# EAGLE design esp8266-blynk2 (EAGLE 7.5.0)
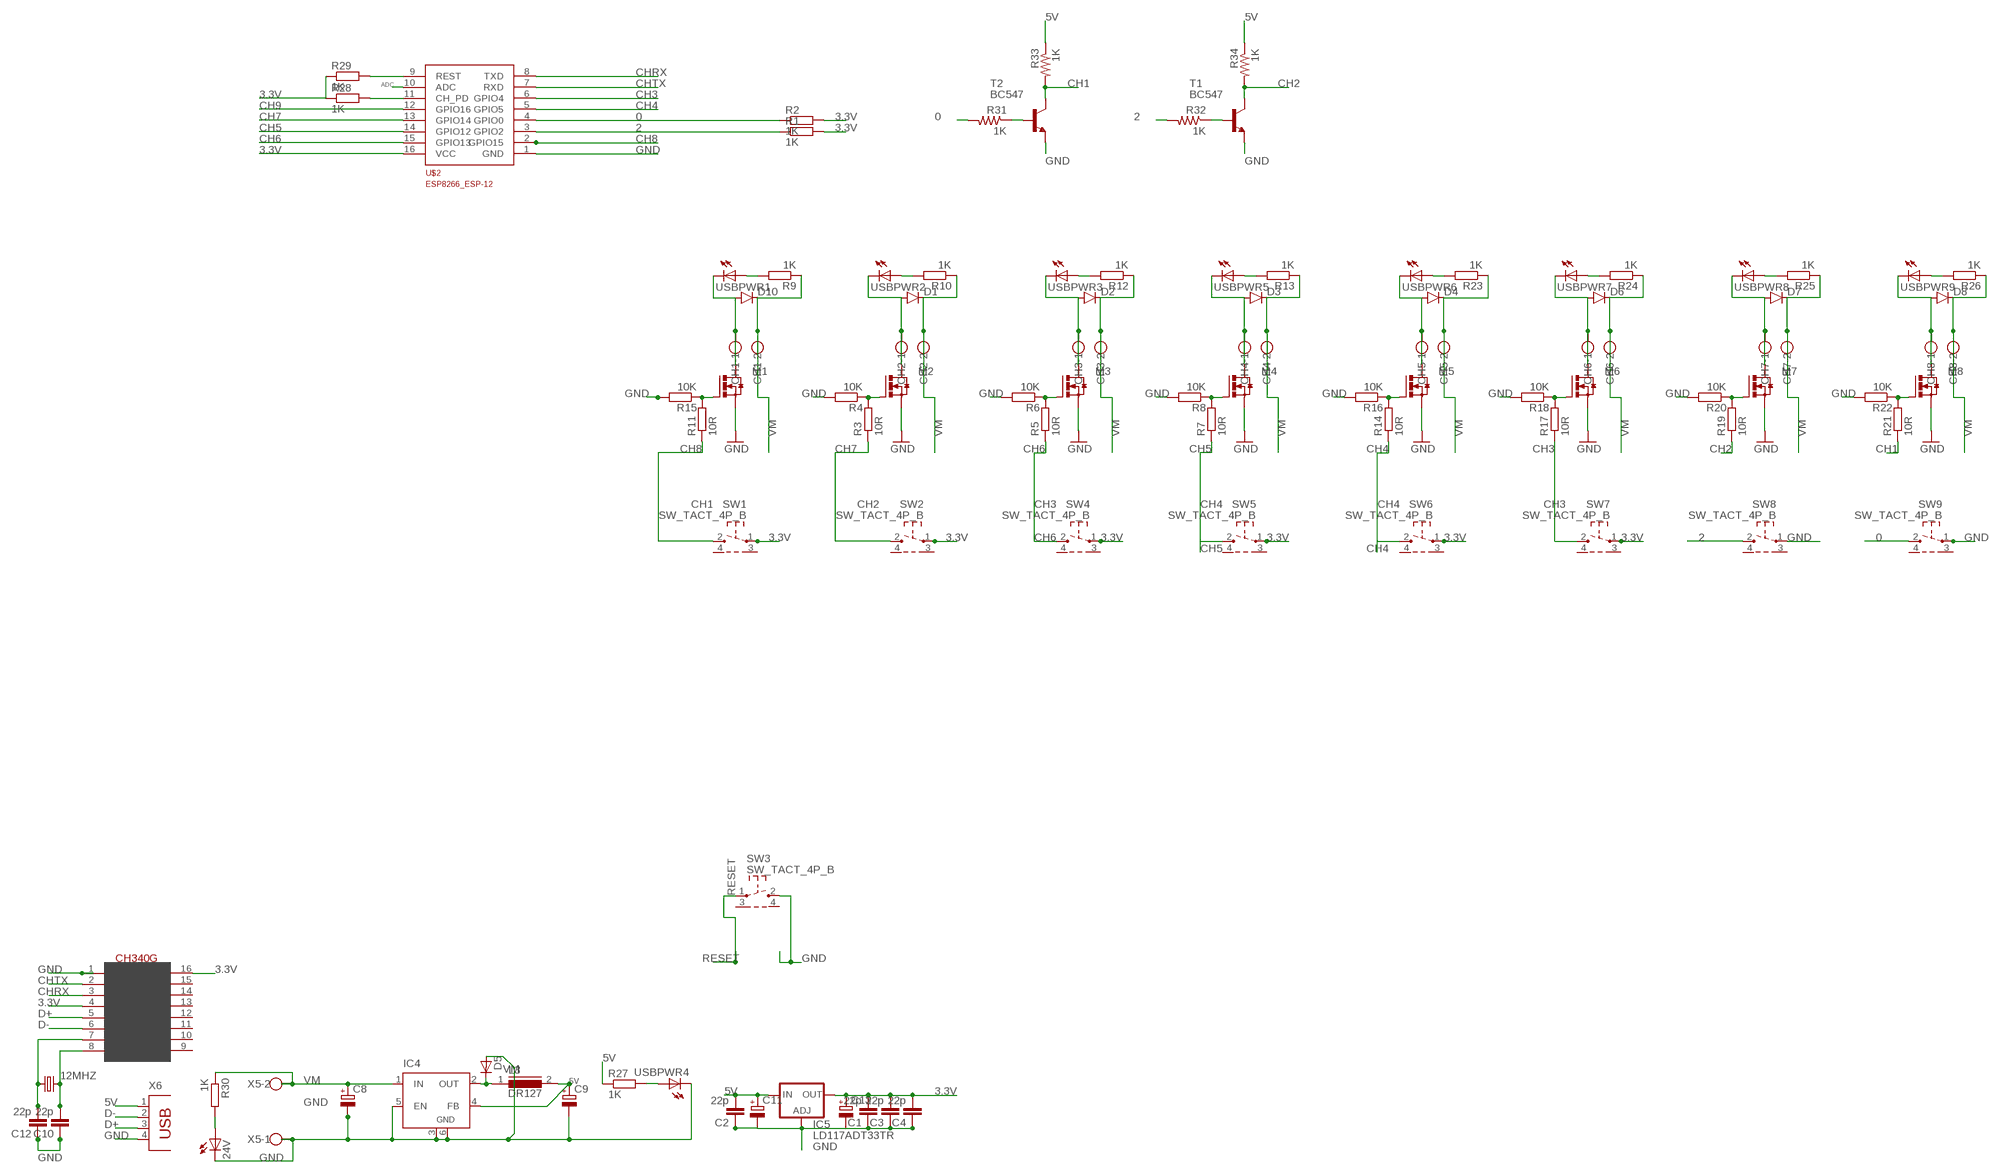
[diagram p0: schematic, sheet 1]

## Parts
12MHZ  CRYSTALHC49UP  [HC49UP]
24V  LED3MM  [LED3MM]
C1  22p  C-EUC1206  [C1206]
C2  22p  C-EUC1206  [C1206]
C3  22p  C-EUC1206  [C1206]
C4  22p  C-EUC1206  [C1206]
C8  CPOL-EUE2.5-7  [E2,5-7]
C9  CPOL-EUE2.5-7  [E2,5-7]
C10  22p  C-EUC1206  [C1206]
C11  CPOL-EUC  [PANASONIC_C]
C12  22p  C-EUC1206  [C1206]
C13  CPOL-EUC  [PANASONIC_C]
CH1  W237-102  [W237-102]
CH2  W237-102  [W237-102]
CH3  W237-102  [W237-102]
CH4  W237-102  [W237-102]
CH5  W237-102  [W237-102]
CH6  W237-102  [W237-102]
CH7  W237-102  [W237-102]
CH8  W237-102  [W237-102]
D1  DIODESMA-ALT  [SMA-DIODE_ALT]
D2  DIODESMA-ALT  [SMA-DIODE_ALT]
D3  DIODESMA-ALT  [SMA-DIODE_ALT]
D4  DIODESMA-ALT  [SMA-DIODE_ALT]
D5  D-SOD-87  [SOD87]
D6  DIODESMA-ALT  [SMA-DIODE_ALT]
D7  DIODESMA-ALT  [SMA-DIODE_ALT]
D8  DIODESMA-ALT  [SMA-DIODE_ALT]
D10  DIODESMA-ALT  [SMA-DIODE_ALT]
IC4  LM2596S  [TO263-5]
IC5  LD117ADT33TR  [DPACK]
L3  DR127  [DR127]
M1  IRLR024N  [TO252]
M2  IRLR024N  [TO252]
M3  IRLR024N  [TO252]
M4  IRLR024N  [TO252]
M5  IRLR024N  [TO252]
M6  IRLR024N  [TO252]
M7  IRLR024N  [TO252]
M8  IRLR024N  [TO252]
R1  1K  R-EU_M1206  [M1206]
R2  1K  R-EU_M1206  [M1206]
R3  10R  R-EU_M1206  [M1206]
R4  10K  R-EU_M1206  [M1206]
R5  10R  R-EU_M1206  [M1206]
R6  10K  R-EU_M1206  [M1206]
R7  10R  R-EU_M1206  [M1206]
R8  10K  R-EU_M1206  [M1206]
R9  1K  R-EU_M1206  [M1206]
R10  1K  R-EU_M1206  [M1206]
R11  10R  R-EU_M1206  [M1206]
R12  1K  R-EU_M1206  [M1206]
R13  1K  R-EU_M1206  [M1206]
R14  10R  R-EU_M1206  [M1206]
R15  10K  R-EU_M1206  [M1206]
R16  10K  R-EU_M1206  [M1206]
R17  10R  R-EU_M1206  [M1206]
R18  10K  R-EU_M1206  [M1206]
R19  10R  R-EU_M1206  [M1206]
R20  10K  R-EU_M1206  [M1206]
R21  10R  R-EU_M1206  [M1206]
R22  10K  R-EU_M1206  [M1206]
R23  1K  R-EU_M1206  [M1206]
R24  1K  R-EU_M1206  [M1206]
R25  1K  R-EU_M1206  [M1206]
R26  1K  R-EU_M1206  [M1206]
R27  1K  R-EU_M1206  [M1206]
R28  1K  R-EU_M1206  [M1206]
R29  1K  R-EU_M1206  [M1206]
R30  1K  R-EU_M1206  [M1206]
R31  1K  R-US_M1206  [M1206]
R32  1K  R-US_M1206  [M1206]
R33  1K  R-US_M1206  [M1206]
R34  1K  R-US_M1206  [M1206]
SW1  SW_TACT_4P_B  [SW_TACT_STANDARD_RIGHT_ANGLE]
SW2  SW_TACT_4P_B  [SW_TACT_STANDARD_RIGHT_ANGLE]
SW3  SW_TACT_4P_B  [SW_TACT_STANDARD_RIGHT_ANGLE]
SW4  SW_TACT_4P_B  [SW_TACT_STANDARD_RIGHT_ANGLE]
SW5  SW_TACT_4P_B  [SW_TACT_STANDARD_RIGHT_ANGLE]
SW6  SW_TACT_4P_B  [SW_TACT_STANDARD_RIGHT_ANGLE]
SW7  SW_TACT_4P_B  [SW_TACT_STANDARD_RIGHT_ANGLE]
SW8  SW_TACT_4P_B  [SW_TACT_STANDARD_RIGHT_ANGLE]
SW9  SW_TACT_4P_B  [SW_TACT_STANDARD_RIGHT_ANGLE]
T1  BC547  [TO92]
T2  BC547  [TO92]
U$2  ESP8266_ESP-12  [ESP8266-ESP12]
U$4  CH340G  [SOIC16]
USBPWR1  LED3MM  [LED3MM]
USBPWR2  LED3MM  [LED3MM]
USBPWR3  LED3MM  [LED3MM]
USBPWR4  LED3MM  [LED3MM]
USBPWR5  LED3MM  [LED3MM]
USBPWR6  LED3MM  [LED3MM]
USBPWR7  LED3MM  [LED3MM]
USBPWR8  LED3MM  [LED3MM]
USBPWR9  LED3MM  [LED3MM]
X5  W237-102  [W237-102]
X6  PN61729  [PN61729]

## Nets
0: R2.1 R31.2 SW9.2 U$2.4(GPIO0)
2: R1.1 R32.2 SW8.2 U$2.3(GPIO2)
3.3V: C1.2 C3.2 C4.2 C13.+ IC5.4(OUT) R1.2 R2.2 R28.1 R29.1 SW1.1 SW2.1 SW4.1 SW5.1 SW6.1 SW7.1 U$2.16(VCC) U$4.4(V3) U$4.16(VCC)
5V: C2.2 C9.+ C11.+ IC4.4(FB) IC5.3(IN) L3.2 R27.1 R33.1 R34.1 X6.1
ADC: U$2.10(ADC)
CH1: R21.1 R33.2 T2.3(C)
CH2: R19.1 R34.2 T1.3(C)
CH3: R17.1 SW7.2 U$2.6(GPIO4)
CH4: R14.1 SW6.2 U$2.5(GPIO5)
CH5: R7.1 SW5.2 U$2.14(GPIO12)
CH6: R5.1 SW4.2 U$2.15(GPIO13)
CH7: R3.1 SW2.2 U$2.13(GPIO14)
CH8: R11.1 SW1.2 U$2.2(GPIO15)
CH9: U$2.12(GPIO16)
CHRX: U$2.8(TXD) U$4.3(RX)
CHTX: U$2.7(RXD) U$4.2(TX)
D+: U$4.5(D+) X6.3
D-: U$4.6(D-) X6.2
GND: 24V.K(C) C1.1 C2.1 C3.1 C4.1 C8.- C9.- C10.1 C11.- C12.1 C13.- D5.2(A) IC4.3(GND) IC4.5(EN) IC4.6(GND) IC5.1(ADJ) M1.2(S) M2.2(S) M3.2(S) M4.2(S) M5.2(S) M6.2(S) M7.2(S) M8.2(S) R4.2 R6.2 R8.2 R15.2 R16.2 R18.2 R20.2 R22.2 SW3.2 SW8.1 SW9.1 T1.1(E) T2.1(E) U$2.1(GND) U$4.1(GND) USBPWR4.K(C) X5.1 X6.4
N$1: M2.1(G) R3.2 R4.1
N$2: M3.1(G) R5.2 R6.1
N$3: M4.1(G) R7.2 R8.1
N$4: R9.2 USBPWR1.A
N$5: 24V.A R30.2
N$6: R10.2 USBPWR2.A
N$7: R12.2 USBPWR3.A
N$8: R13.2 USBPWR5.A
N$9: D5.1(C) IC4.2(OUT) L3.1
N$10: R27.2 USBPWR4.A
N$12: 12MHZ.1 C12.2 U$4.7(XI)
N$13: 12MHZ.2 C10.2 U$4.8(XO)
N$14: R31.1 T2.2(B)
N$15: M5.1(G) R14.2 R16.1
N$17: R32.1 T1.2(B)
N$18: R28.2 U$2.11(CH_PD)
N$20: M6.1(G) R17.2 R18.1
N$24: M7.1(G) R19.2 R20.1
N$28: M8.1(G) R21.2 R22.1
N$29: R23.2 USBPWR6.A
N$30: R24.2 USBPWR7.A
N$31: R25.2 USBPWR8.A
N$32: R26.2 USBPWR9.A
N$67: M1.1(G) R11.2 R15.1
OUT1: CH1.1 D10.A M1.3(D) USBPWR1.K(C)
OUT2: CH2.1 D1.A M2.3(D) USBPWR2.K(C)
OUT3: CH3.1 D2.A M3.3(D) USBPWR3.K(C)
OUT4: CH4.1 D3.A M4.3(D) USBPWR5.K(C)
OUT5: CH5.1 D4.A M5.3(D) USBPWR6.K(C)
OUT6: CH6.1 D6.A M6.3(D) USBPWR7.K(C)
OUT7: CH7.1 D7.A M7.3(D) USBPWR8.K(C)
OUT8: CH8.1 D8.A M8.3(D) USBPWR9.K(C)
RESET: R29.2 SW3.1 U$2.9(REST)
VM: C8.+ CH1.2 CH2.2 CH3.2 CH4.2 CH5.2 CH6.2 CH7.2 CH8.2 D1.C D2.C D3.C D4.C D6.C D7.C D8.C D10.C IC4.1(IN) R9.1 R10.1 R12.1 R13.1 R23.1 R24.1 R25.1 R26.1 R30.1 X5.2
Unconnected: SW1.3 SW1.4 SW2.3 SW2.4 SW3.3 SW3.4 SW4.3 SW4.4 SW5.3 SW5.4 SW6.3 SW6.4 SW7.3 SW7.4 SW8.3 SW8.4 SW9.3 SW9.4 U$4.9(CTS) U$4.10(DSR) U$4.11(RI) U$4.12(DCD) U$4.13(DTR) U$4.14(RTS) U$4.15(RS232)

## Library data of the parts
12MHZ = crystal:CRYSTAL: CRYSTAL; OC_FARNELL: unknown; OC_NEWARK: unknown
24V USBPWR1-USBPWR9 = RepRapjr:LED: LED OSRAM: - CHIPLED LG R971, LG N971, LY N971, LG Q971, LY Q971, LO R971, LY R971 LH N974, LH R974 LS Q976, LO Q976, LY Q976 LO Q996 - Hyper CHIPLED LW Q18S LB Q993, LB Q99A, LB R99A - SideLED LS A670, LO A670, LY A670, LG A670, LP A670 LB A673, LV A673, LT A673, LW A673 LH A674 LY A675 LS A676, LA A676, LO A676, LY A676, LW A676 LS A679, LY A679, LG A679 - Hyper Micro SIDELED® LS Y876, LA Y876, LO Y876, LY Y876 LT Y87S - SmartLED LW L88C, LW L88S LB L89C, LB L89S, LG L890 LS L89K, LO L89K, LY L89K LS L896, LA L896, LO L896, LY L896 - TOPLED LS T670, LO T670, LY T670, LG T670, LP T670 LSG T670, LSP T670, LSY T670, LOP T670, LYG T670 LG T671, LOG T671, LSG T671 LB T673, LV T673, LT T673, LW T673 LH T674 LS T676, LA T676, LO T676, LY T676, LB T676, LH T676, LSB T676, LW T676 LB T67C, LV T67C, LT T67C, LS T67K, LO T67K, LY T67K, LW E67C LS E67B, LA E67B, LO E67B, LY E67B, LB E67C, LV E67C, LT E67C LW T67C LS T679, LY T679, LG T679 LS T770, LO T770, LY T770, LG T770, LP T770 LB T773, LV T773, LT T773, LW T773 LH T774 LS E675, LA E675, LY E675, LS T675 LS T776, LA T776, LO T776, LY T776, LB T776 LHGB T686 LT T68C, LB T68C - Hyper Mini TOPLED® LB M676 - Mini TOPLED Santana® LG M470 LS M47K, LO M47K, LY M47K Source: http://www.osram.convergy.de LUXEON: - LUMILED® LXK2-PW12-R00, LXK2-PW12-S00, LXK2-PW14-U00, LXK2-PW14-V00 LXK2-PM12-R00, LXK2-PM12-S00, LXK2-PM14-U00 LXK2-PE12-Q00, LXK2-PE12-R00, LXK2-PE12-S00, LXK2-PE14-T00, LXK2-PE14-U00 LXK2-PB12-K00, LXK2-PB12-L00, LXK2-PB12-M00, LXK2-PB14-N00, LXK2-PB14-P00, LXK2-PB14-Q00 LXK2-PR12-L00, LXK2-PR12-M00, LXK2-PR14-Q00, LXK2-PR14-R00 LXK2-PD12-Q00, LXK2-PD12-R00, LXK2-PD12-S00 LXK2-PH12-R00, LXK2-PH12-S00 LXK2-PL12-P00, LXK2-PL12-Q00, LXK2-PL12-R00 Source: www.luxeon.com KINGBRIGHT: KA-3528ASYC Source: www.kingbright.com
C1-C4 C10 C12 = rcl:C-EU: CAPACITOR, European symbol
C8 C9 = resistor:CPOL-EU: POLARIZED CAPACITOR, European symbol
C11 C13 = rcl:CPOL-EU: POLARIZED CAPACITOR, European symbol
CH1-CH8 X5 = con-wago-500:W237-102: WAGO SCREW CLAMP; MPN: 237-102; OC_FARNELL: unknown; OC_NEWARK: 70K9898
D1-D4 D6-D8 D10 = SparkFun-DiscreteSemi:DIODE: Diode These are standard reverse protection diodes and small signal diodes. SMA package can handle up to about 1A. SOD-323 can handle about 200mA. What the SOD-323 package when ordering, there are some mfgs out there that are 5-pin packages.
D5 = semicon-smd-ipc:D-: DIODE unfilled
IC4 = linear:LM2596S: STEP-DOWN VOLTAGE REGULATOR
IC5 = v-reg:LD117A?*: Low drop fixed and adjustable positive voltage regulators 1 A Source: http://www.st.com/stonline/products/literature/ds/7194/ld1117axx.pdf
L3 = inductors:DR127: High Power Density, High Efficiency, Shielded Inductors Source: coiltronics_dr_series.pdf
M1-M8 = to252(1):IRLR024N
R1 R2 R9 R10 R12 R13 R23-R30 = rcl:R-EU_: RESISTOR, European symbol
R3-R8 R11 R14-R22 = resistor:R-EU_: RESISTOR, European symbol
R31-R34 = adafruit:R-US_: RESISTOR, American symbol
SW1-SW9 = dp_devices:SW_TACT_4P_B
T1 T2 = transistor:BC547: NPN TRANSISTOR
U$2 = ESP8266-ESP12:ESP8266_ESP-12: ESP8266 ESP-12 Discussion about pins here: http://www.esp8266.com/viewtopic.php?f=13&t=1429
U$4 = usb-serial:CH340G
X6 = con-berg:PN61729: BERG USB connector; OC_FARNELL: unknown; OC_NEWARK: unknown

## Net classes
1 power: width 0.6 mm, clearance 0.305 mm

## Board
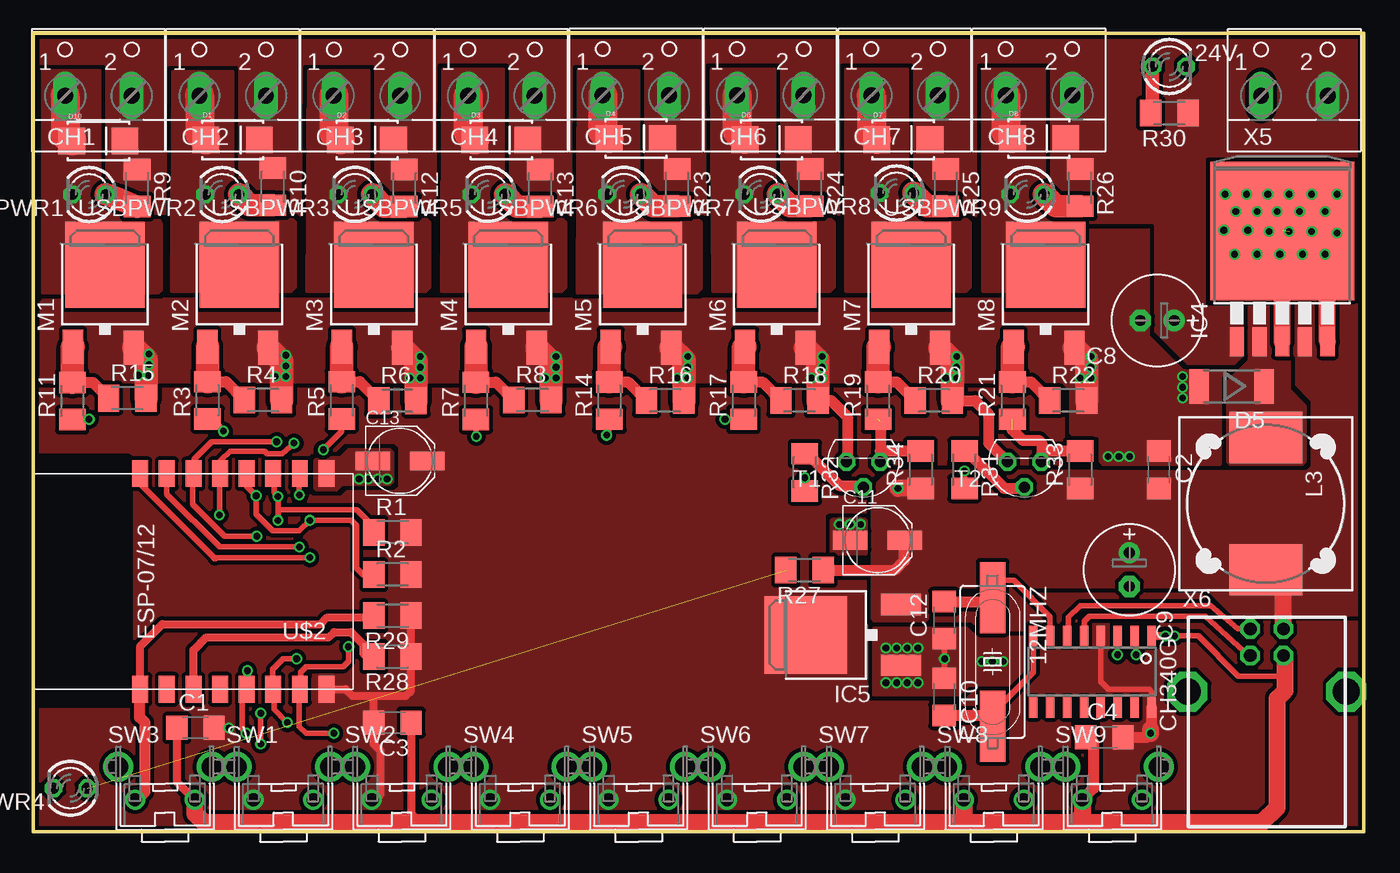
[diagram p1: board, top side]
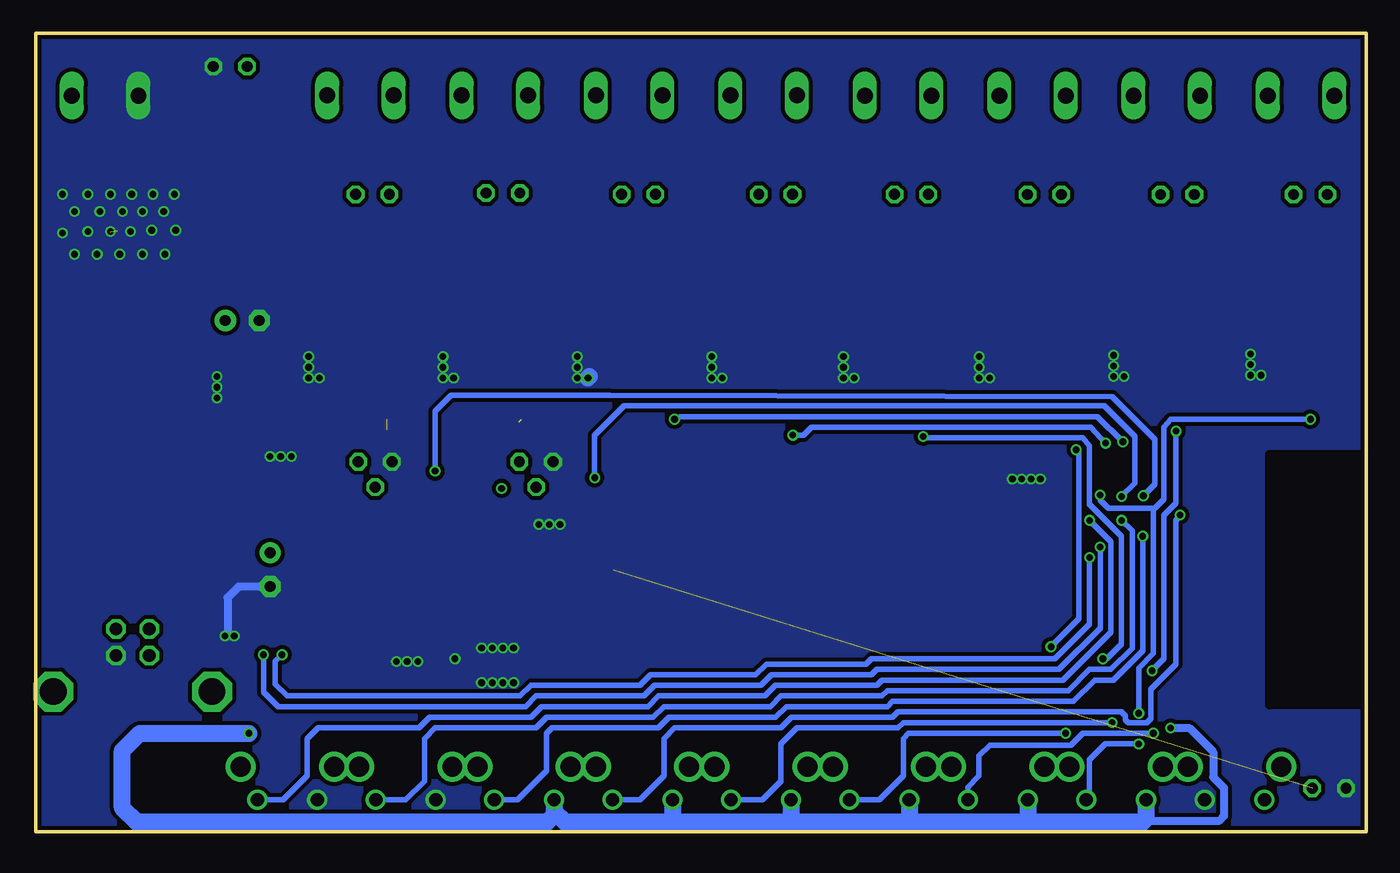
[diagram p2: board, bottom side, seen from below]

Size 100 x 60 mm. Coordinates in mm from the lower left corner, seen from the top.
Outline: 0,60 100,60 100,0 0,0 0,60
Copper layers (1*16): Top 0.035mm / dielectric 1.5mm / Bottom 0.035mm
Design rules "dirt_cheap_dirty_boards.v1": minimum track width 5mil, minimum drill 12mil, track to track 5mil, track to pad 5mil, pad to pad 5mil, via to via 5mil, smd to smd 0mil, copper to edge 10mil, drill to drill 10mil, minimum pad ring 10mil, minimum via ring 6mil, stop-mask expansion 2mil, vias tented up to drill 25mil, thermal gap 10mil
tRestrict: area 0.2,9.6 to 7.2,28.1
bRestrict: area -0.1,9.5 to 7.3,28.4

### Footprints (pad centres in the part's own frame; a part is rotated, then mirrored left to right if it is on the bottom)
HC49UP = smd 5.334 x 1.93: 1 -4.826,0; 2 4.826,0
LED3MM = drill 0.813 octagon: A -1.27,0; K 1.27,0
C1206 = smd 1.6 x 1.8: 1 -1.4,0; 2 1.4,0
E2,5-7 = drill 0.813 pad 1.6: + -1.27,0 | drill 0.813 pad 1.6 octagon: - 1.27,0
PANASONIC_C = smd 2.6 x 1.4: + 2.05,0; - -2.05,0
W237-102 = drill 1.194 long: 1 -2.5,-1.27; 2 2.5,-1.27
SMA-DIODE_ALT = smd 2 x 2: A -2,0; C 2,0
SOD87 = smd 1.45 x 2.6: 1 -2.445,0; 2 2.445,0
TO263-5 = smd 1.067 x 2.159: 1 -3.404,-5.791; 2 -1.702,-5.791; 3 0,-5.791; 4 1.702,-5.791; 5 3.404,-5.791 | smd 10.8 x 10.41: 6 0,2.54
DPACK = smd 1.6 x 3: 1 -2.28,-4.8; 3 2.28,-4.8 | smd 5.8 x 6.2: 4 0,2.38
DR127 = smd 3.85 x 5.5: 1 -4.975,0; 2 4.975,0
TO252 = smd 1.524 x 2.54: 1 -2.407,-3.657; 2 2.153,-3.72 | smd 5.97 x 6.48: 3 0,2.5
M1206 = smd 1.6 x 2: 1 -1.4,0; 2 1.4,0
SW_TACT_STANDARD_RIGHT_ANGLE = drill 1: 1 -2.25,0; 2 2.25,0 | drill 1.5: 3 -3.5,2.5; 4 3.5,2.5
TO92 = drill 0.813 octagon: 1 1.27,0; 2 0,1.905; 3 -1.27,0
ESP8266-ESP12 = smd 2 x 1.2: 1 16.2,2; 2 16.2,4; 3 16.2,6; 4 16.2,8; 5 16.2,10; 6 16.2,12; 7 16.2,14; 8 16.2,16; 9 0,16; 10 0,14; 11 0,12; 12 0,10; 13 0,8; 14 0,6; 15 0,4; 16 0,2
SOIC16 = smd 0.635 x 1.524: 1 -4.445,-2.695; 2 -3.175,-2.695; 3 -1.905,-2.695; 4 -0.635,-2.695; 5 0.635,-2.695; 6 1.905,-2.695; 7 3.175,-2.695; 8 4.445,-2.695; 9 4.445,2.695; 10 3.175,2.695; 11 1.905,2.695; 12 0.635,2.695; 13 -0.635,2.695; 14 -1.905,2.695; 15 -3.175,2.695; 16 -4.445,2.695
PN61729 = drill 0.95 octagon: 1 1.25,4.71; 2 -1.25,4.71; 3 -1.25,2.71; 4 1.25,2.71 | drill 2 octagon: P$1 -5.969,0; P$2 5.969,0

### Placement (x,y rotation side)
12MHZ  72.11,12.77 270 top
24V  85.4,57.5 0 top
C1  12.2,7.8 0 top
C2  84.6,27.2 270 top
C3  27,8.2 180 top
C4  80.5,7.1 0 top
C8  84.49,38.41 180 top
C9  82.4,19.69 270 top
C10  68.47,10.14 270 top
C11  63.47,21.91 0 top
C12  68.47,15.89 90 top
C13  27.57,27.87 0 top
CH1  4.89,56.59 0 top
CH2  14.99,56.59 0 top
CH3  25.09,56.59 0 top
CH4  35.19,56.59 0 top
CH5  45.3,56.6 0 top
CH6  55.4,56.6 0 top
CH7  65.5,56.6 0 top
CH8  75.6,56.6 0 top
D1  14.99,51.99 0 top
D2  25.09,51.99 0 top
D3  35.19,51.99 0 top
D4  45.3,52.1 0 top
D5  90.07,33.47 180 top
D6  55.5,52 0 top
D7  65.4,52 0 top
D8  75.6,52.1 0 top
D10  4.89,51.89 0 top
IC4  93.89,42.61 0 top
IC5  60.43,14.79 90 top
L3  92.64,24.65 270 top
M1  5.4,40.1 0 top
M2  15.5,40.1 0 top
M3  25.6,40.1 0 top
M4  35.7,40.1 0 top
M5  45.8,40.1 0 top
M6  55.9,40.1 0 top
M7  66,40.1 0 top
M8  76.1,40.1 0 top
R1  27,22.5 0 top
R2  27,19.32 0 top
R3  13.1,32.42 90 top
R4  17.27,32.44 0 top
R5  23.19,32.42 90 top
R6  27.37,32.39 0 top
R7  33.28,32.38 90 top
R8  37.52,32.44 0 top
R9  7.82,48.37 270 top
R10  18.01,48.47 270 top
R11  2.94,32.37 90 top
R12  27.91,48.37 270 top
R13  38.11,48.37 270 top
R14  43.3,32.4 90 top
R15  7.07,32.58 0 top
R16  47.5,32.4 0 top
R17  53.4,32.4 90 top
R18  57.6,32.4 0 top
R19  63.5,32.4 90 top
R20  67.7,32.4 0 top
R21  73.6,32.4 90 top
R22  77.8,32.4 0 top
R23  48.4,48.4 270 top
R24  58.4,48.4 270 top
R25  68.6,48.4 270 top
R26  78.7,48.4 270 top
R27  57.97,19.67 180 top
R28  27,13.17 180 top
R29  27,16.24 180 top
R30  85.4,54 180 top
R31  70,27.2 270 top
R32  58,27 270 top
R33  78.7,27.2 90 top
R34  66.7,27.2 90 top
SW1  18.8,2.4 0 top
SW2  27.7,2.4 0 top
SW3  9.9,2.4 0 top
SW4  36.6,2.4 0 top
SW5  45.5,2.4 0 top
SW6  54.4,2.4 0 top
SW7  63.3,2.4 0 top
SW8  72.2,2.4 0 top
SW9  81.1,2.4 0 top
T1  62.4,27.8 180 top
T2  74.5,27.8 180 top
U$2  24.04,10.71 90 top
U$4  79.61,12.03 180 top
USBPWR1  4.19,47.88 180 top
USBPWR2  14.19,47.89 180 top
USBPWR3  24.19,47.89 180 top
USBPWR4  2.79,3.27 180 top
USBPWR5  34.19,47.89 180 top
USBPWR6  44.4,47.9 180 top
USBPWR7  54.7,47.9 180 top
USBPWR8  64.9,48 180 top
USBPWR9  74.7,47.9 180 top
X5  94.8,56.59 0 top
X6  92.73,10.53 0 top

### Tracks (layer width: path | path; a pad name or v marks a point on that pad's centre or on a via)
0  (via drill 0.5 pad 0.25)
  Top 0.406: 16,26.95 U$2.4 16.04,25.96 v16.75,25.25 16.75,23.85 18,22.6 20,22.6 v20.8,23.4 23.9,23.4 24.3,23 24.3,19.8 24.8,19.3 25.57,19.3 R2.1 | v70,27.1 R31.2
  Top 0.61: 25.52,19.4 R2.1
  Bottom 0.406: v16.75,25.25 15.9,26.1 15.9,29.5 19.1,32.7 56.9,32.8 68.8,32.8 70,31.6 v70,27.1 | SW9.2 81.4,2.4 79.6,4.2 79.6,7 78.8,7.8 71.2,7.8 70.4,8.6 62.8,8.6 62,9.4 54,9.4 53.2,10.2 45.2,10.2 44.4,11 36.8,11 36.4,11.4 22.8,11.4 19.2,15 19.2,21.8 v20.8,23.4
2  (via drill 0.5 pad 0.25)
  Top 0.406: 18,26.95 U$2.3 | 18.1,26.96 U$2.3 | R32.2 v58,26.6 | U$2.3 18.1,26.85 18.1,25.5 v18.4,25.2 18.4,24.3 | v18.4,23.4 18.4,24.3 | R1.1 25.6,22.9 24.3,24.2 18.5,24.2 18.4,24.3
  Bottom 0.406: v58,26.6 58,29.8 55.8,32 19.7,32 17.4,29.7 17.4,26.2 v18.4,25.2 | SW8.2 72.2,2.4 70.8,3.8 70.8,7 70,7.8 62.4,7.8 61.6,8.6 53.6,8.6 52.8,9.4 44.8,9.4 44,10.2 36.4,10.2 36,10.6 22.4,10.6 20.8,12.2 19.2,12.2 17.6,13.8 17.6,22.6 v18.4,23.4
3.3V  (via drill 0.5 pad 0.25)
  Top 0.406: U$4.4 80.25,11.25 80.8,10.7 83.9,10.7 84.1,10.5 84.1,9.38 U$4.16
  Top 0.61: U$2.16 23.49,10.71 24,10.2 25.6,10.2 | 25.6,10.2 28,10.2 28.4,10.6 R28.1 R29.1 | 25.6,10.2 C3.2 25.6,6.6 26.1,6.1 26.1,2.8 25.7,2.4 SW2.1 | C1.2 v14.7,7.8
  Top 0.813: U$4.16 84.06,7.36 v84,7.4 83.7,7.1 C4.2
  Top 1.27: v84,7.4 84,7.7
  Bottom 0.61: v14.7,7.8 13.3,7.8 11.5,6 11.5,4.1 10.7,3.3 10.7,1.2 11.1,0.8 16.4,0.8 16.55,0.95
  Bottom 1.27: SW1.1 16.55,0.95 16.8,0.7 25.4,0.7 | 25.4,0.7 34.6,0.7 | 34.6,0.7 43.3,0.7 | 43.3,0.7 52.2,0.7 | 52.2,0.7 60.2,0.7 61.05,1.55 SW7.1 61.05,1.25 61.6,0.7 92.4,0.7 93.5,1.8 93.5,6.1 92.2,7.4 v84,7.4 | SW6.1 52.15,0.75 52.2,0.7 | SW5.1 43.25,0.75 43.3,0.7 | SW4.1 34.35,0.95 34.6,0.7 | SW2.1 25.45,0.75 25.4,0.7
  pour Top (isolate 0.305, rank 6, no thermals): 99.7,60.2 0.2,60.2 0,60 0,0 0.2,-0.2 99.9,-0.2 100.1,0 100.1,59.8
5V  (via drill 0.5 pad 0.25)
  Top 0.813: R27.1 64.77,19.67 65.5,20.4 65.5,21.89 C11.+
  Top 1.27: R34.1 v65,25.8 | X6.1 93.98,18.34 L3.2
  pour Top (isolate 0.305, rank 5, no thermals): 94.8,39.7 94.8,33.6 96.1,32.3 96.1,27.6 95.6,27.1 64.4,27.1 63.4,26.1 63.4,25.4 63.1,25.1 63.1,16 63.3,15.7 66.9,15.7 67.2,16 67.2,18.2 67.4,18.4 88.1,18.4 90.2,16.3 99.6,16.3 99.6,39.7
CH1  (1 unrouted)
  Top 0.813: 73.6,30.2 74.4,29.4 75.6,29.4 75.8,29.2 75.8,28.4 | 75.8,28.4 75.8,27.83 T2.3 | R33.2 76,28.6 75.8,28.4
CH2  (1 unrouted)
  Top 0.813: R34.2 63.67,28.6 T1.3 63.7,27.97 63.7,30.5
  Top 1.016: 63.7,30.5 63.7,30.8
CH3  (via drill 0.5 pad 0.25)
  Top 0.406: R17.1 v52,31 | 12.1,26.96 U$2.6 | v18.3,29.3 13.4,29.3 12.1,28 12.1,27.5 12,27.4 12,26.95 U$2.6 | v16.8,22.2 14.4,22.2 12,24.6 12,26.86 U$2.6
  Bottom 0.406: v52,31 51.8,31 51.6,31.2 20.2,31.2 v18.3,29.3 | SW7.2 63.8,2.4 61.6,4.6 61.6,7.4 61.2,7.8 53.2,7.8 52.4,8.6 44.4,8.6 43.6,9.4 36,9.4 35.6,9.8 22,9.8 20.4,11.4 19,11.4 16.8,13.6 v16.8,22.2
CH4  (via drill 0.5 pad 0.25)
  Top 0.406: R14.1 43.3,30 v43.1,29.8 | 14,26.95 U$2.5 | v19.6,29.2 18.7,28.4 17.6,28.4 17.4,28.6 14.8,28.6 14.1,27.9 14.1,26.96 U$2.5 | v14,23.8 14,26.86 U$2.5
  Bottom 0.406: v43.1,29.8 42.3,29.8 41.7,30.4 20.7,30.4 v19.6,29.2 | SW6.2 54.6,2.4 52.8,4.2 52.8,7 52,7.8 44,7.8 43.2,8.6 35.6,8.6 35.2,9 18.4,9 18.1,8.7 18.1,8.4 17.9,8.2 16.5,8.2 16.2,8.5 16.2,10.7 14.3,12.6 14.3,23.4 14,23.7 v14,23.8
CH5  (via drill 0.5 pad 0.25)
  Top 0.406: R7.1 33.28,29.72 v33.3,29.7 | 18.1,10.77 U$2.14 | v19.8,13 18.8,13 18,12.2 18,10.75 U$2.14 | 18,10.66 U$2.14 | v19.1,8.2 18.1,9.2 18.1,10.46 U$2.14
  Bottom 0.406: v33.3,29.7 33.2,29.6 21.3,29.6 20.8,29 20.8,24.6 18.4,22.2 18.4,14.1 19.5,13 v19.8,13 | SW5.2 45.4,2.4 44,3.8 44,6.6 42.8,7.8 35.2,7.8 34.8,8.2 v19.1,8.2
CH6  (via drill 0.5 pad 0.25)
  Top 0.406: 23.3,31 R5.1 23.19,30.09 v21.8,28.7 | v23.7,13.9 23.7,12.8 23.3,12.4 20.5,12.4 20.1,12 20.1,10.77 U$2.15 20,10.66 20,7.9 20.5,7.4 v22.6,7.4
  Bottom 0.406: SW4.2 36.6,2.4 34.8,4.2 34.8,7 34.4,7.4 v22.6,7.4 | v21.8,28.7 21.6,28.5 21.6,16 v23.7,13.9
CH7  (via drill 0.5 pad 0.25)
  Top 0.406: R3.1 13.58,31.02 v14.3,30.1 | v16.1,12.1 16.1,10.77 U$2.13 | 16,10.66 U$2.13 | 16.1,10.65 U$2.13 | v16,7.4 15.7,7.7 15.7,10.37 U$2.13
  Top 0.813: R3.1 13,31
  Bottom 0.406: v14.3,30.1 14.3,24.7 15.2,23.8 15.2,13 v16.1,12.1 | SW2.2 29.95,3.35 29.1,4.2 29.1,5.7 28.3,6.5 22.2,6.5 21.3,7.4 v16,7.4
CH8  (via drill 0.5 pad 0.25)
  Top 0.406: R11.1 4.17,30.97 v4.2,31 | v20,25.3 20,26.86 U$2.2 | v17.1,6.6 v17.1,8.9
  Bottom 0.406: v4.2,31 14.7,31 15.2,30.4 15.2,25 15.9,24.3 16,24.3 | v20,25.3 20,24.9 19.4,24.3 16,24.3 | 16,24.3 16,13.4 17.1,12.3 v17.1,8.9 | SW1.2 20.8,2.65 20.8,5.4 19.6,6.6 v17.1,6.6
CHRX  (via drill 0.5 pad 0.25)
  Top 0.406: U$2.8 8.04,26.16 13.6,20.6 | 13.6,20.6 13.7,20.5 13.6,20.5 13.6,20.6 | 13.6,20.6 v20.8,20.6 | v81.5,13.3 81.5,14.71 U$4.3
  Bottom 0.406: v20.8,20.6 20.8,15.6 23.4,13 37.2,13 37.6,12.6 45.1,12.6 45.9,11.8 53.8,11.8 54.6,11 62.8,11 63.6,10.2 81.1,10.2 82,11.1 82,12.8 v81.5,13.3
CHTX  (via drill 0.5 pad 0.25)
  Top 0.406: U$2.7 10.04,25.36 14,21.4 v20,21.4 | v82.9,13.3 82.9,14.62 U$4.2
  Bottom 0.406: v20,21.4 20,15.3 23.1,12.2 36.8,12.2 37.2,11.8 44.7,11.8 45.5,11 53.5,11 54.3,10.2 62.4,10.2 63.2,9.4 81.8,9.4 82.9,10.5 v82.9,13.3
D+
  Top 0.406: X6.3 91.36,13.24 88.1,16.2 79.4,16.2 79,15.8 79,14.75 U$4.5
D-
  Top 0.406: X6.2 90.56,15.24 88.5,17 78.7,17 77.8,16.1 77.8,14.82 U$4.6
GND  (via drill 0.5 pad 0.25)  (1 unrouted)
  Top 0.406: C12.1 C10.1 | U$4.1 87.57,14.73 90.6,11.7 93.5,11.7 94,12.2 94,13.22 X6.4
  Top 0.61: C1.1 10.8,3.75 SW3.2 | C3.1 28.4,1.3 28.3,1.2 28.6,1.2 29.1,0.7 | U$4.1 85.07,14.73 v85.1,14.7 v85.8,14.7
  Top 0.813: v19,35 18.67,35.33 18.67,35.36 19,35.69 v19,35.8 | v8.7,35.1 8.7,35.17 8.47,35.4 | 8.47,35.46 8.47,35.67 v8.7,35.9 | v29.1,34.9 v29.1,35.7 v29.1,35.69 28.77,35.36 | v39.3,34.9 39.22,34.9 38.92,35.2 | v39.3,35.7 v39.3,35.69 38.92,35.31 | v49.2,34.9 49.2,35 48.9,35.3 | 48.9,35.43 48.93,35.43 v49.2,35.7 | v59.3,34.9 59.3,35.13 58.92,35.52 59.1,35.7 v59.3,35.7 | 69.1,35.43 69.13,35.43 | 69.13,35.43 v69.4,35.7 | 69.13,35.43 69.1,35.4 69.1,35.2 v69.4,34.9 | 79.2,35.43 79.03,35.43 79,35.4 79.2,35.4 v79.5,35.7 | v79.5,34.9 79.4,34.9 79.2,35.1 | R18.2 60,32.4 61.2,31.2 61.2,27.87 T1.1 | R20.2 70.8,32.4 71.8,31.4 71.8,29.23 T2.1 | C4.1 79.3,7.1 79.7,6.7 79.7,3.25 SW9.1
  Top 1.27: IC4.3 IC4.6 97.29,41.75 IC4.5 | SW3.2 12.15,1.35 12.8,0.7 29.1,0.7 70,0.7 | 70,0.7 78.3,0.7 | SW8.1 69.95,0.75 70,0.7 | SW9.1 78.85,1.25 78.3,0.7 | 78.3,0.7 92.4,0.7 93.5,1.8 93.5,10 94.1,10.6 94.1,13.12 X6.4
  Top 1.778: R22.2 79.2,35.1 79.2,35.43 M8.2 | R20.2 69.1,35.4 69.1,35.43 M7.2 | R18.2 59,35.43 58.92,35.52 M6.2 | R16.2 48.9,35.3 48.9,35.43 M5.2 | R8.2 38.92,35.2 38.92,35.31 M4.2 | R6.2 28.77,35.36 M3.2 | R4.2 18.67,35.36 M2.2 | R15.2 8.47,35.4 8.47,35.46 M1.2
  Bottom 0.61: C9.- 84.78,18.42 85.6,17.6 85.6,14.9 v85.8,14.7
  Bottom 1.27: 58.4,34.2 v58.5,34.1
  other vias: 7.9,34.3 8.7,34.3 18.2,34.2 19,34.2 28.3,34.1 29.1,34.1 48.4,34.1 49.2,34.1 59.3,34.1 68.6,34.1 69.4,34.1 78.7,34.1 79.5,34.1 38.5,34.1 39.3,34.1 7.9,34.3 8.7,34.3 18.2,34.2 19,34.2 28.3,34.1 29.1,34.1 38.5,34.1 39.3,34.1 48.4,34.1 49.2,34.1 59.3,34.1 69.4,34.1 68.6,34.1 78.7,34.1 79.5,34.1 86.4,32.6 86.4,33.4 86.4,34.2 80.8,28.2 81.6,28.2 82.4,28.2 64.1,13.8 64.9,13.8 65.7,13.8 66.5,13.8 64.1,11.2 64.9,11.2 65.7,11.2 66.5,11.2 68.5,13 71.3,12.8 72.1,12.8 72.9,12.8 89.6,47.9 91.2,47.9 92.8,47.9 94.4,47.9 96.1,47.9 98,47.9 97.1,46.6 95.2,46.6 93.5,46.6 92,46.6 90.4,46.6 89.5,45.2 91.3,45.2 92.9,45.1 94.4,45.1 96.1,45.1 98,45 97.1,43.4 95.4,43.4 93.7,43.4 92,43.4 90.3,43.4 24.5,26.5 25.2,26.5 25.9,26.5 26.6,26.5 62.2,23.1 61.4,23.1 60.6,23.1
  pour Top (isolate 0.305, rank 4, no thermals): 79.4,45.2 84,45.2 84,37.2 86.6,34.6 89.4,34.6 89.4,27.8 89.2,27.6 80.4,27.6 80.2,27.8 80.2,29.6 80,29.8 78.2,29.8 78,30 78,33.2 77.4,33.8 0.6,33.8 0.6,39.8 0.8,40 79.2,40 79.4,40.2
  pour Bottom (isolate 0.305, rank 5, no thermals): -0.1,60.8 99.8,60.8 100.4,60.2 100.4,-0.1 99.9,-0.6 0.2,-0.6 -0.4,0 -0.4,60.5
  pour Top (isolate 0.305, rank 5, no thermals): 24.1,28.7 26.8,28.7 27,28.5 27,26.3 26.8,26.1 23.2,26.1 22.8,25.7 21.3,25.7 21.2,25.8 21.2,27.9 21.4,28.1 23.1,28.1 23.7,28.7
  pour Top (isolate 0.305, no thermals): 63.2,15.3 70.2,15.3 70.9,14.6 74.4,14.6 74.5,12.2 73.3,11 70.3,11 69.6,10.3 63.2,10.3
  pour Top (isolate 0.305, rank 5, no thermals): 60.1,23.5 62.5,23.5 62.6,23.4 62.6,20.9 60,20.9 60,23.4
N$1
  Top 0.813: R3.2 14.49,33.82 R4.1
  Top 1.778: R3.2 M2.1
N$2
  Top 0.813: R5.2 24.54,33.82 R6.1
  Top 1.778: R5.2 M3.1
N$3
  Top 0.813: R7.2 34.78,33.78 R8.1
  Top 1.778: R7.2 33.28,36.43 M4.1
N$4
  Top 1.676: R9.2 6.38,47.57 USBPWR1.A
N$5
  Top 1.016: 24V.A 84.13,54.13 R30.2
N$6
  Top 1.676: R10.2 16.28,47.07 USBPWR2.A
N$7
  Top 1.676: R12.2 26.38,46.97 USBPWR3.A
N$8
  Top 1.676: R13.2 36.38,46.97 USBPWR5.A
N$9
  pour Top (isolate 0.305, rank 2, no thermals): 91.4,39.4 91.4,35.4 89.8,33.8 89.8,27.8 90,27.6 95.4,27.6 95.6,27.8 95.6,32 94.4,33.2 94.4,35.4 93.2,35.4 93,35.6 93,39.4
N$10  (1 unrouted)
N$12
  Top 0.406: U$4.7 76.44,16.16 73.7,18.9 71.82,18.9 12MHZ.1
  Top 0.813: C12.2 71.81,17.3 12MHZ.1
N$13
  Top 0.406: U$4.8 75.17,11.97 72.4,9.2 71.85,9.2 71.93,8.81 12MHZ.2
  Top 0.813: C10.2 71.86,8.74 71.93,8.81
N$14
  Top 0.813: R31.1 70.2,28.6 73,25.8 74.41,25.8 T2.2
N$15
  Top 0.813: R14.2 44.7,33.8 R16.1
  Top 1.778: R14.2 43.3,36.35 M5.1
N$17
  Top 0.813: R32.1 58.2,28.4 60.6,26 62.3,26 T1.2
N$18
  Top 0.61: R28.2 25.03,13.17 24.8,13.4 24.8,14.1 23.9,15 22.6,15 22.2,14.6 13,14.6 12.04,13.64 U$2.11
N$20
  Top 0.813: R17.2 54.8,33.8 R18.1
  Top 1.778: R17.2 53.4,36.35 M6.1
N$24
  Top 0.813: R19.2 64.9,33.8 R20.1
  Top 1.778: R19.2 63.5,36.35 M7.1
N$28
  Top 0.813: R21.2 75,33.8 R22.1
  Top 1.778: R21.2 73.6,36.35 M8.1
N$29
  Top 1.676: R23.2 46.57,47 USBPWR6.A
N$30
  Top 1.676: R24.2 56.87,47 USBPWR7.A
N$31
  Top 1.676: R25.2 67.17,47 USBPWR8.A
N$32
  Top 1.676: R26.2 76.87,47 USBPWR9.A
N$67
  Top 0.813: R11.2 4.48,33.77 R15.1
  Top 1.778: R11.2 2.94,36.39 M1.1
OUT1
  Top 2.184: CH1.1 2.4,52.39 D10.A
  pour Top (isolate 0.305, no thermals): 5,57.2 5,48 6.7,45.9 9.5,45.9 9.6,45.7 9.6,40.7 9.4,40.5 0.7,40.5 0.7,57.2
OUT2
  Top 2.184: CH2.1 12.49,52.49 D1.A
  pour Top (isolate 0.305, no thermals): 15,57.1 15,48.1 16.7,46 19.5,46 19.7,45.8 19.7,40.9 19.4,40.6 10.4,40.6 10.5,57.1
OUT3
  Top 2.184: CH3.1 22.59,52.49 D2.A
  pour Top (isolate 0.305, no thermals): 25.2,57.2 25.2,48.1 26.9,46 29.6,46 29.8,45.8 29.8,40.9 29.5,40.6 20.6,40.6 20.7,57.2
OUT4
  Top 2.184: CH4.1 32.69,52.49 D3.A
  pour Top (isolate 0.305, no thermals): 35.3,57.3 35.3,48.1 37,46 39.8,46 40,45.8 40,40.9 39.7,40.6 30.7,40.6 30.8,57.3
OUT5
  Top 2.184: CH5.1 42.8,52.6 D4.A
  pour Top (isolate 0.305, no thermals): 45.5,57.2 45.5,48 47.2,45.9 50,45.9 50.2,45.8 50.2,40.8 49.9,40.5 40.9,40.5 41,57.2
OUT6
  Top 2.184: CH6.1 52.9,52.6 D6.A
  pour Top (isolate 0.305, no thermals): 55.7,57.3 55.7,48.1 57.4,46 60,46 60.2,45.8 60.2,40.9 59.9,40.6 51.1,40.6 51,57.3
OUT7
  Top 2.184: CH7.1 63,52.4 D7.A
  pour Top (isolate 0.305, no thermals): 65.7,57.3 65.7,48.1 67.4,46 70.2,46 70.4,45.8 70.4,40.9 70.1,40.6 61.1,40.6 61.1,57.3
OUT8
  Top 2.184: CH8.1 73.1,52.6 D8.A
  pour Top (isolate 0.305, no thermals): 76,57.3 76,48.1 77.7,46 78.3,46 78.4,45.9 78.4,40.6 71.4,40.6 71.4,57.3
RESET
  Top 0.61: 25.4,15.6 25.54,15.74 R29.2 25.46,16.1 22.1,16.1 21.6,15.6 9.7,15.6 8.04,13.94 8.04,11.4 U$2.9
  Top 0.813: SW3.1 7.8,2.4 8.4,3 8.4,8.2 8,8.6 8,11.36 8.04,11.4
VM
  Top 0.61: 47.5,51.9 D4.C | 67.6,51.8 D7.C
  pour Top (isolate 0.305, rank 3, no thermals): 99.8,60.2 0.6,60.2 0.6,45.8 84.2,45.8 84.4,45.6 84.4,37.6 86.8,35.2 90.6,35.2 91,35.6 91,39.4 88.2,39.4 88,39.6 88,50.6 88.2,50.8 99.8,50.8